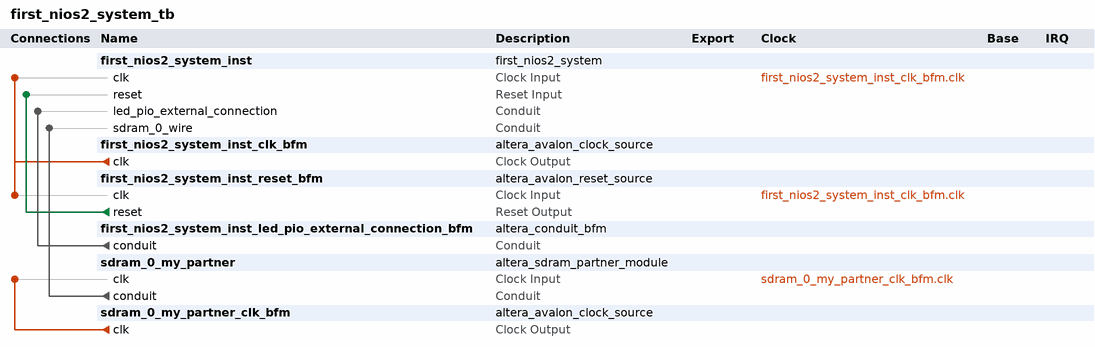
[diagram p0: system contents]
# Platform Designer (Qsys) system first_nios2_system_tb, Cyclone III EP3C16F484C6
# Parameters at their usual value, and those the tool derives, are not listed.
package require -exact qsys 12.1
create_system first_nios2_system_tb
set_project_property DEVICE_FAMILY {Cyclone III}
set_project_property DEVICE EP3C16F484C6

add_instance first_nios2_system_inst first_nios2_system 1.0

add_instance first_nios2_system_inst_clk_bfm altera_avalon_clock_source 12.1

add_instance first_nios2_system_inst_reset_bfm altera_avalon_reset_source 12.1
set_instance_parameter_value first_nios2_system_inst_reset_bfm ASSERT_HIGH_RESET 0
set_instance_parameter_value first_nios2_system_inst_reset_bfm INITIAL_RESET_CYCLES 50

add_instance first_nios2_system_inst_led_pio_external_connection_bfm altera_conduit_bfm 12.1
set_instance_parameter_value first_nios2_system_inst_led_pio_external_connection_bfm CLOCKED_SIGNAL false
set_instance_parameter_value first_nios2_system_inst_led_pio_external_connection_bfm ENABLE_RESET false
set_instance_parameter_value first_nios2_system_inst_led_pio_external_connection_bfm SIGNAL_WIDTHS 10
set_instance_parameter_value first_nios2_system_inst_led_pio_external_connection_bfm SIGNAL_DIRECTIONS input

add_instance sdram_0_my_partner altera_sdram_partner_module 11.0
set_instance_parameter_value sdram_0_my_partner SDRAM_DATA_WIDTH 16
set_instance_parameter_value sdram_0_my_partner SDRAM_COL_WIDTH 8
set_instance_parameter_value sdram_0_my_partner SDRAM_ROW_WIDTH 12
set_instance_parameter_value sdram_0_my_partner CONTR_NAME sdram_0

add_instance sdram_0_my_partner_clk_bfm altera_avalon_clock_source 12.1

# connections
add_connection first_nios2_system_inst_clk_bfm.clk first_nios2_system_inst.clk clock
add_connection first_nios2_system_inst_clk_bfm.clk first_nios2_system_inst_reset_bfm.clk clock
add_connection sdram_0_my_partner_clk_bfm.clk sdram_0_my_partner.clk clock
add_connection first_nios2_system_inst_reset_bfm.reset first_nios2_system_inst.reset reset
add_connection first_nios2_system_inst_led_pio_external_connection_bfm.conduit first_nios2_system_inst.led_pio_external_connection conduit
add_connection sdram_0_my_partner.conduit first_nios2_system_inst.sdram_0_wire conduit

save_system first_nios2_system_tb.qsys
